# Altium schematic sheet Hall sensor V1 sensor_1.SchDoc
size A2
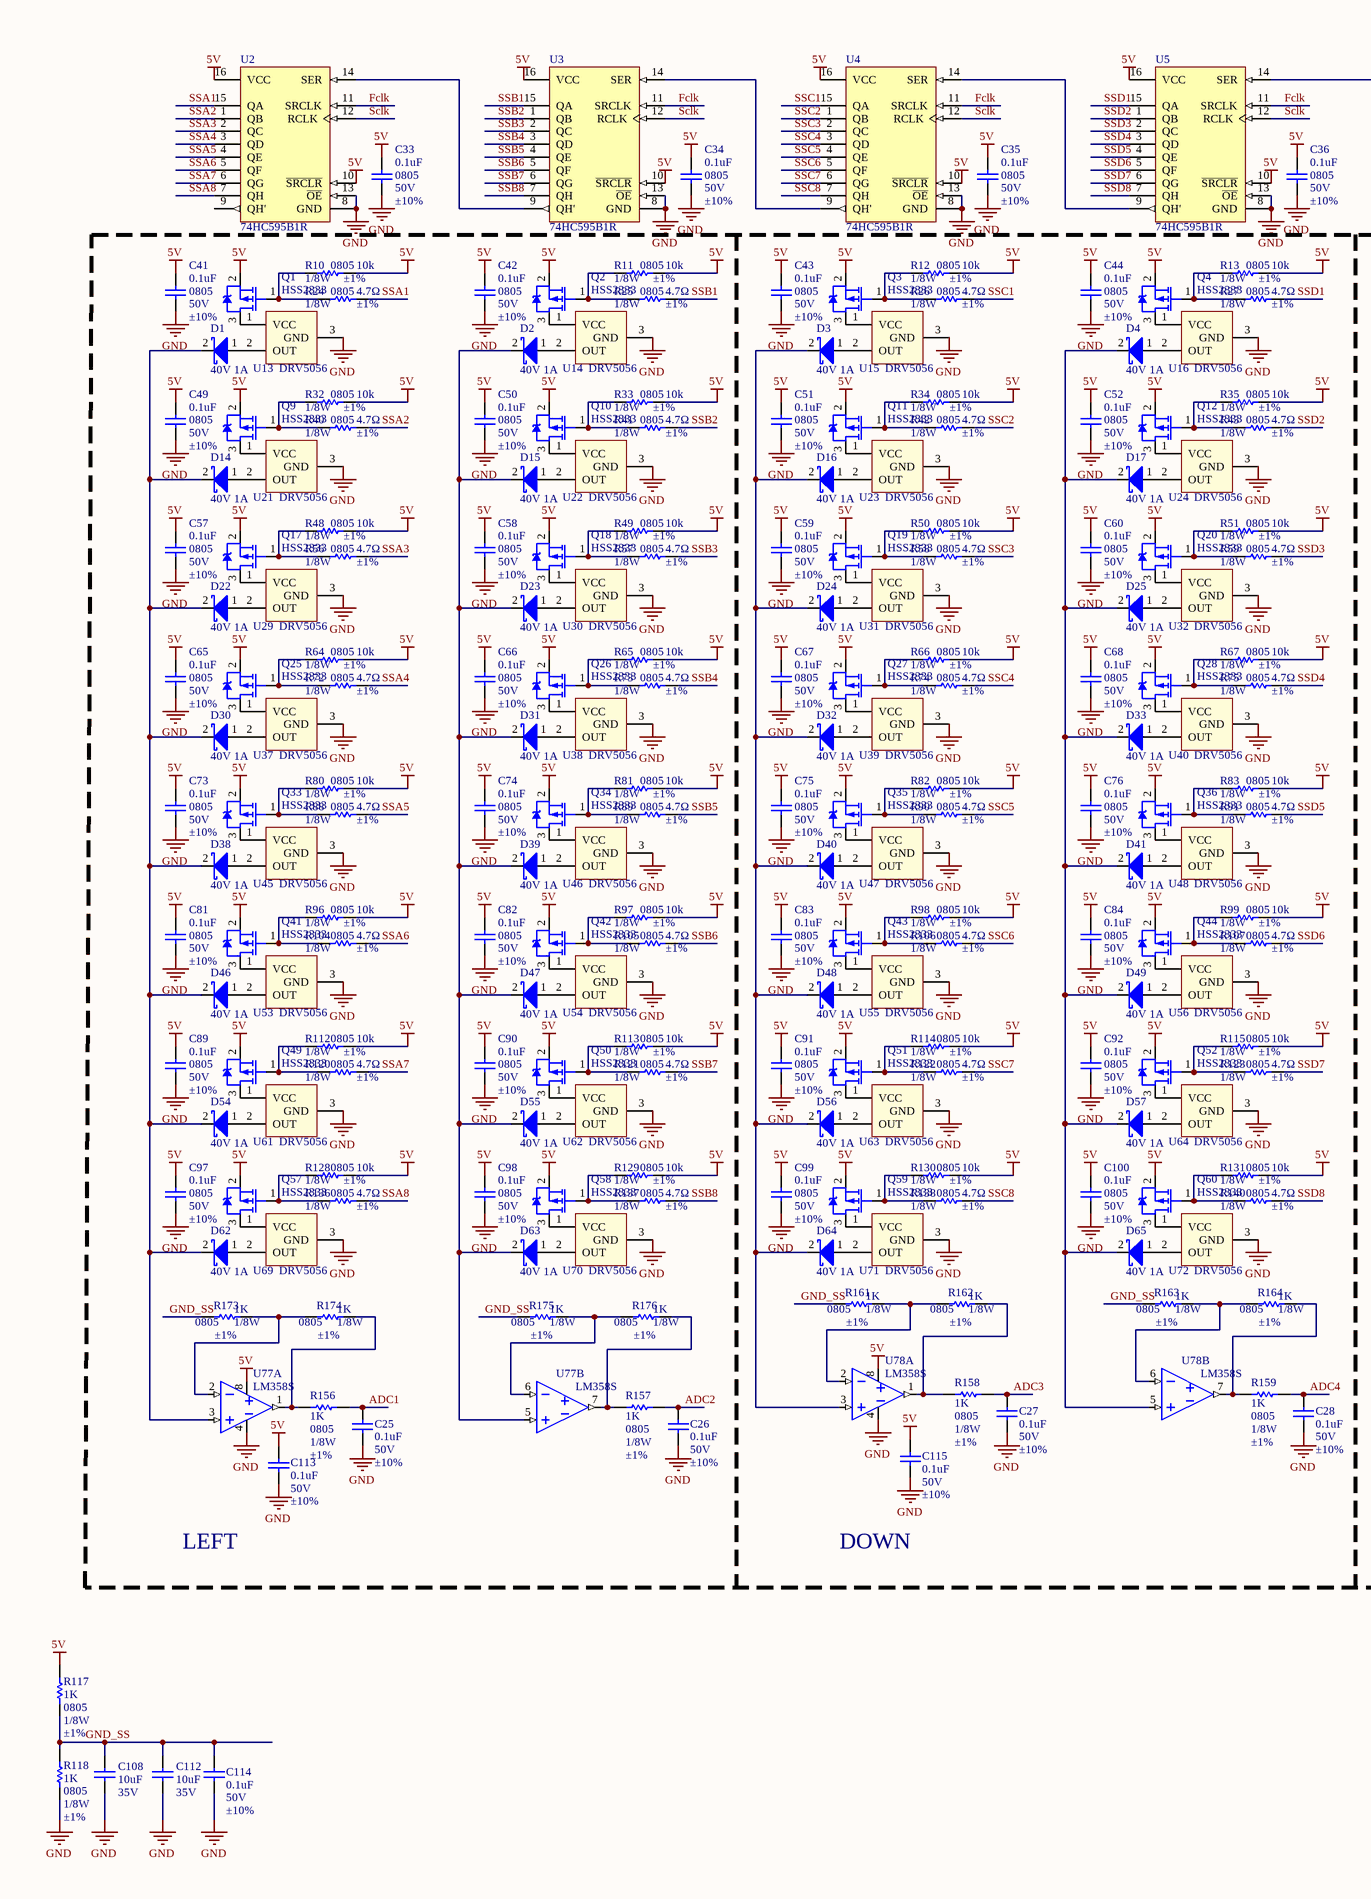
[diagram p0: Hall sensor V1 sensor_1.SchDoc, left]
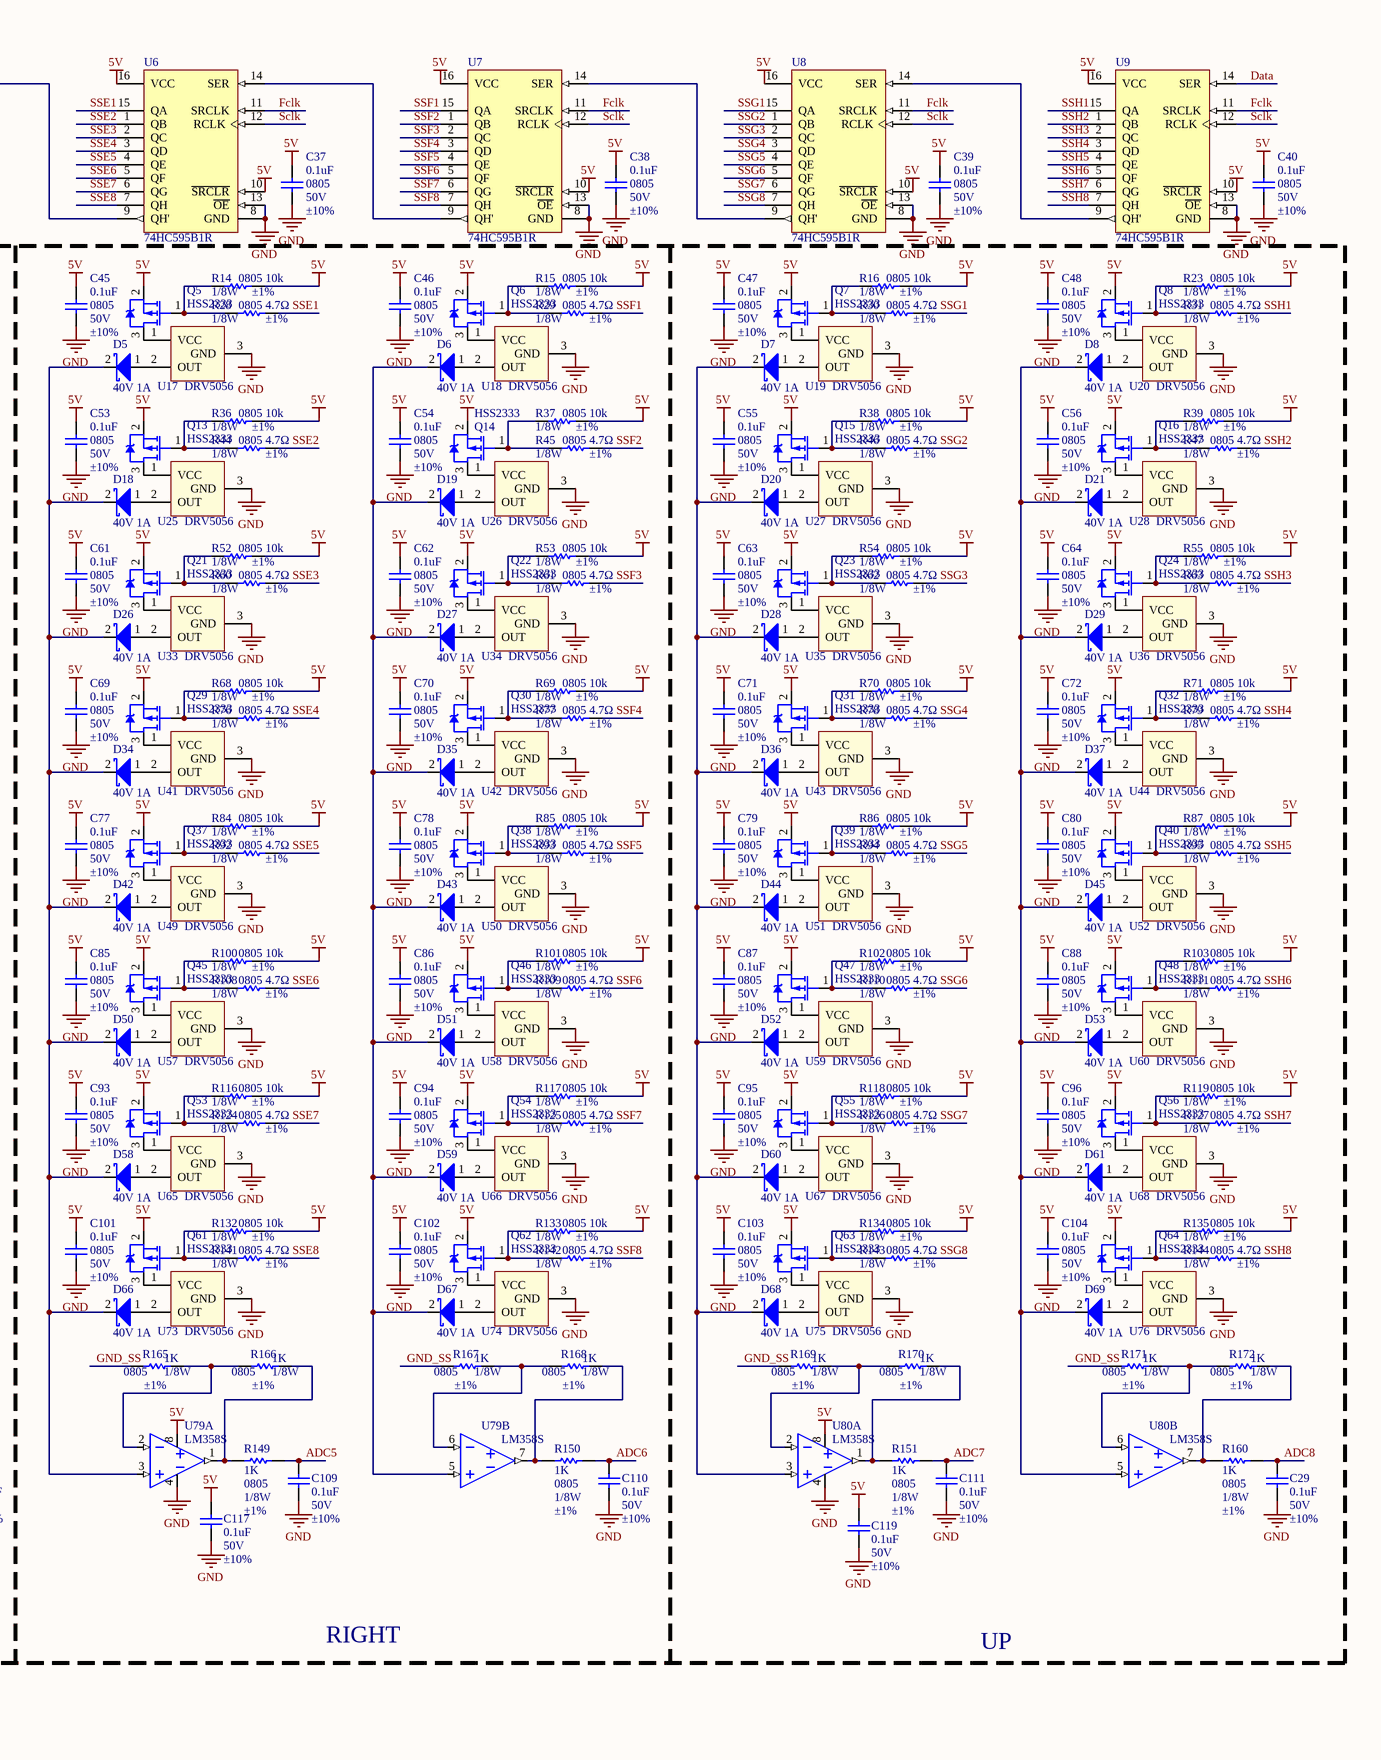
[diagram p1: Hall sensor V1 sensor_1.SchDoc, right]

## Parts
(Parts that share a designator on the sheet are numbered #1, #2 ... from top to bottom, then left to right.)
C25  Voltage: 50V  Tolerance: ±10%  [CAP_SMD_0805]  (hidden comment: 0.1uF)
C26  Voltage: 50V  Tolerance: ±10%  [CAP_SMD_0805]  (hidden comment: 0.1uF)
C27  Voltage: 50V  Tolerance: ±10%  [CAP_SMD_0805]  (hidden comment: 0.1uF)
C28  Voltage: 50V  Tolerance: ±10%  [CAP_SMD_0805]  (hidden comment: 0.1uF)
C29  Voltage: 50V  Tolerance: ±10%  [CAP_SMD_0805]  (hidden comment: 0.1uF)
C33  PCB Footprint: 0805  Voltage: 50V  Tolerance: ±10%  [CAP_SMD_0805]  (hidden comment: 0.1uF)
C34  PCB Footprint: 0805  Voltage: 50V  Tolerance: ±10%  [CAP_SMD_0805]  (hidden comment: 0.1uF)
C35  PCB Footprint: 0805  Voltage: 50V  Tolerance: ±10%  [CAP_SMD_0805]  (hidden comment: 0.1uF)
C36  PCB Footprint: 0805  Voltage: 50V  Tolerance: ±10%  [CAP_SMD_0805]  (hidden comment: 0.1uF)
C37  PCB Footprint: 0805  Voltage: 50V  Tolerance: ±10%  [CAP_SMD_0805]  (hidden comment: 0.1uF)
C38  PCB Footprint: 0805  Voltage: 50V  Tolerance: ±10%  [CAP_SMD_0805]  (hidden comment: 0.1uF)
C39  PCB Footprint: 0805  Voltage: 50V  Tolerance: ±10%  [CAP_SMD_0805]  (hidden comment: 0.1uF)
C40  PCB Footprint: 0805  Voltage: 50V  Tolerance: ±10%  [CAP_SMD_0805]  (hidden comment: 0.1uF)
C41  PCB Footprint: 0805  Voltage: 50V  Tolerance: ±10%  [CAP_SMD_0805]  (hidden comment: 0.1uF)
C42  PCB Footprint: 0805  Voltage: 50V  Tolerance: ±10%  [CAP_SMD_0805]  (hidden comment: 0.1uF)
C43  PCB Footprint: 0805  Voltage: 50V  Tolerance: ±10%  [CAP_SMD_0805]  (hidden comment: 0.1uF)
C44  PCB Footprint: 0805  Voltage: 50V  Tolerance: ±10%  [CAP_SMD_0805]  (hidden comment: 0.1uF)
C45  PCB Footprint: 0805  Voltage: 50V  Tolerance: ±10%  [CAP_SMD_0805]  (hidden comment: 0.1uF)
C46  PCB Footprint: 0805  Voltage: 50V  Tolerance: ±10%  [CAP_SMD_0805]  (hidden comment: 0.1uF)
C47  PCB Footprint: 0805  Voltage: 50V  Tolerance: ±10%  [CAP_SMD_0805]  (hidden comment: 0.1uF)
C48  PCB Footprint: 0805  Voltage: 50V  Tolerance: ±10%  [CAP_SMD_0805]  (hidden comment: 0.1uF)
C49  PCB Footprint: 0805  Voltage: 50V  Tolerance: ±10%  [CAP_SMD_0805]  (hidden comment: 0.1uF)
C50  PCB Footprint: 0805  Voltage: 50V  Tolerance: ±10%  [CAP_SMD_0805]  (hidden comment: 0.1uF)
C51  PCB Footprint: 0805  Voltage: 50V  Tolerance: ±10%  [CAP_SMD_0805]  (hidden comment: 0.1uF)
C52  PCB Footprint: 0805  Voltage: 50V  Tolerance: ±10%  [CAP_SMD_0805]  (hidden comment: 0.1uF)
C53  PCB Footprint: 0805  Voltage: 50V  Tolerance: ±10%  [CAP_SMD_0805]  (hidden comment: 0.1uF)
C54  PCB Footprint: 0805  Voltage: 50V  Tolerance: ±10%  [CAP_SMD_0805]  (hidden comment: 0.1uF)
C55  PCB Footprint: 0805  Voltage: 50V  Tolerance: ±10%  [CAP_SMD_0805]  (hidden comment: 0.1uF)
C56  PCB Footprint: 0805  Voltage: 50V  Tolerance: ±10%  [CAP_SMD_0805]  (hidden comment: 0.1uF)
C57  PCB Footprint: 0805  Voltage: 50V  Tolerance: ±10%  [CAP_SMD_0805]  (hidden comment: 0.1uF)
C58  PCB Footprint: 0805  Voltage: 50V  Tolerance: ±10%  [CAP_SMD_0805]  (hidden comment: 0.1uF)
C59  PCB Footprint: 0805  Voltage: 50V  Tolerance: ±10%  [CAP_SMD_0805]  (hidden comment: 0.1uF)
C60  PCB Footprint: 0805  Voltage: 50V  Tolerance: ±10%  [CAP_SMD_0805]  (hidden comment: 0.1uF)
C61  PCB Footprint: 0805  Voltage: 50V  Tolerance: ±10%  [CAP_SMD_0805]  (hidden comment: 0.1uF)
C62  PCB Footprint: 0805  Voltage: 50V  Tolerance: ±10%  [CAP_SMD_0805]  (hidden comment: 0.1uF)
C63  PCB Footprint: 0805  Voltage: 50V  Tolerance: ±10%  [CAP_SMD_0805]  (hidden comment: 0.1uF)
C64  PCB Footprint: 0805  Voltage: 50V  Tolerance: ±10%  [CAP_SMD_0805]  (hidden comment: 0.1uF)
C65  PCB Footprint: 0805  Voltage: 50V  Tolerance: ±10%  [CAP_SMD_0805]  (hidden comment: 0.1uF)
C66  PCB Footprint: 0805  Voltage: 50V  Tolerance: ±10%  [CAP_SMD_0805]  (hidden comment: 0.1uF)
C67  PCB Footprint: 0805  Voltage: 50V  Tolerance: ±10%  [CAP_SMD_0805]  (hidden comment: 0.1uF)
C68  PCB Footprint: 0805  Voltage: 50V  Tolerance: ±10%  [CAP_SMD_0805]  (hidden comment: 0.1uF)
C69  PCB Footprint: 0805  Voltage: 50V  Tolerance: ±10%  [CAP_SMD_0805]  (hidden comment: 0.1uF)
C70  PCB Footprint: 0805  Voltage: 50V  Tolerance: ±10%  [CAP_SMD_0805]  (hidden comment: 0.1uF)
C71  PCB Footprint: 0805  Voltage: 50V  Tolerance: ±10%  [CAP_SMD_0805]  (hidden comment: 0.1uF)
C72  PCB Footprint: 0805  Voltage: 50V  Tolerance: ±10%  [CAP_SMD_0805]  (hidden comment: 0.1uF)
C73  PCB Footprint: 0805  Voltage: 50V  Tolerance: ±10%  [CAP_SMD_0805]  (hidden comment: 0.1uF)
C74  PCB Footprint: 0805  Voltage: 50V  Tolerance: ±10%  [CAP_SMD_0805]  (hidden comment: 0.1uF)
C75  PCB Footprint: 0805  Voltage: 50V  Tolerance: ±10%  [CAP_SMD_0805]  (hidden comment: 0.1uF)
C76  PCB Footprint: 0805  Voltage: 50V  Tolerance: ±10%  [CAP_SMD_0805]  (hidden comment: 0.1uF)
C77  PCB Footprint: 0805  Voltage: 50V  Tolerance: ±10%  [CAP_SMD_0805]  (hidden comment: 0.1uF)
C78  PCB Footprint: 0805  Voltage: 50V  Tolerance: ±10%  [CAP_SMD_0805]  (hidden comment: 0.1uF)
C79  PCB Footprint: 0805  Voltage: 50V  Tolerance: ±10%  [CAP_SMD_0805]  (hidden comment: 0.1uF)
C80  PCB Footprint: 0805  Voltage: 50V  Tolerance: ±10%  [CAP_SMD_0805]  (hidden comment: 0.1uF)
C81  PCB Footprint: 0805  Voltage: 50V  Tolerance: ±10%  [CAP_SMD_0805]  (hidden comment: 0.1uF)
C82  PCB Footprint: 0805  Voltage: 50V  Tolerance: ±10%  [CAP_SMD_0805]  (hidden comment: 0.1uF)
C83  PCB Footprint: 0805  Voltage: 50V  Tolerance: ±10%  [CAP_SMD_0805]  (hidden comment: 0.1uF)
C84  PCB Footprint: 0805  Voltage: 50V  Tolerance: ±10%  [CAP_SMD_0805]  (hidden comment: 0.1uF)
C85  PCB Footprint: 0805  Voltage: 50V  Tolerance: ±10%  [CAP_SMD_0805]  (hidden comment: 0.1uF)
C86  PCB Footprint: 0805  Voltage: 50V  Tolerance: ±10%  [CAP_SMD_0805]  (hidden comment: 0.1uF)
C87  PCB Footprint: 0805  Voltage: 50V  Tolerance: ±10%  [CAP_SMD_0805]  (hidden comment: 0.1uF)
C88  PCB Footprint: 0805  Voltage: 50V  Tolerance: ±10%  [CAP_SMD_0805]  (hidden comment: 0.1uF)
C89  PCB Footprint: 0805  Voltage: 50V  Tolerance: ±10%  [CAP_SMD_0805]  (hidden comment: 0.1uF)
C90  PCB Footprint: 0805  Voltage: 50V  Tolerance: ±10%  [CAP_SMD_0805]  (hidden comment: 0.1uF)
C91  PCB Footprint: 0805  Voltage: 50V  Tolerance: ±10%  [CAP_SMD_0805]  (hidden comment: 0.1uF)
C92  PCB Footprint: 0805  Voltage: 50V  Tolerance: ±10%  [CAP_SMD_0805]  (hidden comment: 0.1uF)
C93  PCB Footprint: 0805  Voltage: 50V  Tolerance: ±10%  [CAP_SMD_0805]  (hidden comment: 0.1uF)
C94  PCB Footprint: 0805  Voltage: 50V  Tolerance: ±10%  [CAP_SMD_0805]  (hidden comment: 0.1uF)
C95  PCB Footprint: 0805  Voltage: 50V  Tolerance: ±10%  [CAP_SMD_0805]  (hidden comment: 0.1uF)
C96  PCB Footprint: 0805  Voltage: 50V  Tolerance: ±10%  [CAP_SMD_0805]  (hidden comment: 0.1uF)
C97  PCB Footprint: 0805  Voltage: 50V  Tolerance: ±10%  [CAP_SMD_0805]  (hidden comment: 0.1uF)
C98  PCB Footprint: 0805  Voltage: 50V  Tolerance: ±10%  [CAP_SMD_0805]  (hidden comment: 0.1uF)
C99  PCB Footprint: 0805  Voltage: 50V  Tolerance: ±10%  [CAP_SMD_0805]  (hidden comment: 0.1uF)
C100  PCB Footprint: 0805  Voltage: 50V  Tolerance: ±10%  [CAP_SMD_0805]  (hidden comment: 0.1uF)
C101  PCB Footprint: 0805  Voltage: 50V  Tolerance: ±10%  [CAP_SMD_0805]  (hidden comment: 0.1uF)
C102  PCB Footprint: 0805  Voltage: 50V  Tolerance: ±10%  [CAP_SMD_0805]  (hidden comment: 0.1uF)
C103  PCB Footprint: 0805  Voltage: 50V  Tolerance: ±10%  [CAP_SMD_0805]  (hidden comment: 0.1uF)
C104  PCB Footprint: 0805  Voltage: 50V  Tolerance: ±10%  [CAP_SMD_0805]  (hidden comment: 0.1uF)
C108  Voltage: 35V  [CAP_SMD_0805]  (hidden comment: 10uF)
C109  Voltage: 50V  Tolerance: ±10%  [CAP_SMD_0805]  (hidden comment: 0.1uF)
C110  Voltage: 50V  Tolerance: ±10%  [CAP_SMD_0805]  (hidden comment: 0.1uF)
C111  Voltage: 50V  Tolerance: ±10%  [CAP_SMD_0805]  (hidden comment: 0.1uF)
C112  Voltage: 35V  [CAP_SMD_0805]  (hidden comment: 10uF)
C113  Voltage: 50V  Tolerance: ±10%  [CAP_SMD_0805]  (hidden comment: 0.1uF)
C114  Voltage: 50V  Tolerance: ±10%  [CAP_SMD_0805]  (hidden comment: 0.1uF)
C115  Voltage: 50V  Tolerance: ±10%  [CAP_SMD_0805]  (hidden comment: 0.1uF)
C117  Voltage: 50V  Tolerance: ±10%  [CAP_SMD_0805]  (hidden comment: 0.1uF)
C119  Voltage: 50V  Tolerance: ±10%  [CAP_SMD_0805]  (hidden comment: 0.1uF)
D1  40V 1A  [Diode SS14 (DO-214AC)]
D2  40V 1A  [Diode SS14 (DO-214AC)]
D3  40V 1A  [Diode SS14 (DO-214AC)]
D4  40V 1A  [Diode SS14 (DO-214AC)]
D5  40V 1A  [Diode SS14 (DO-214AC)]
D6  40V 1A  [Diode SS14 (DO-214AC)]
D7  40V 1A  [Diode SS14 (DO-214AC)]
D8  40V 1A  [Diode SS14 (DO-214AC)]
D14  40V 1A  [Diode SS14 (DO-214AC)]
D15  40V 1A  [Diode SS14 (DO-214AC)]
D16  40V 1A  [Diode SS14 (DO-214AC)]
D17  40V 1A  [Diode SS14 (DO-214AC)]
D18  40V 1A  [Diode SS14 (DO-214AC)]
D19  40V 1A  [Diode SS14 (DO-214AC)]
D20  40V 1A  [Diode SS14 (DO-214AC)]
D21  40V 1A  [Diode SS14 (DO-214AC)]
D22  40V 1A  [Diode SS14 (DO-214AC)]
D23  40V 1A  [Diode SS14 (DO-214AC)]
D24  40V 1A  [Diode SS14 (DO-214AC)]
D25  40V 1A  [Diode SS14 (DO-214AC)]
D26  40V 1A  [Diode SS14 (DO-214AC)]
D27  40V 1A  [Diode SS14 (DO-214AC)]
D28  40V 1A  [Diode SS14 (DO-214AC)]
D29  40V 1A  [Diode SS14 (DO-214AC)]
D30  40V 1A  [Diode SS14 (DO-214AC)]
D31  40V 1A  [Diode SS14 (DO-214AC)]
D32  40V 1A  [Diode SS14 (DO-214AC)]
D33  40V 1A  [Diode SS14 (DO-214AC)]
D34  40V 1A  [Diode SS14 (DO-214AC)]
D35  40V 1A  [Diode SS14 (DO-214AC)]
D36  40V 1A  [Diode SS14 (DO-214AC)]
D37  40V 1A  [Diode SS14 (DO-214AC)]
D38  40V 1A  [Diode SS14 (DO-214AC)]
D39  40V 1A  [Diode SS14 (DO-214AC)]
D40  40V 1A  [Diode SS14 (DO-214AC)]
D41  40V 1A  [Diode SS14 (DO-214AC)]
D42  40V 1A  [Diode SS14 (DO-214AC)]
D43  40V 1A  [Diode SS14 (DO-214AC)]
D44  40V 1A  [Diode SS14 (DO-214AC)]
D45  40V 1A  [Diode SS14 (DO-214AC)]
D46  40V 1A  [Diode SS14 (DO-214AC)]
D47  40V 1A  [Diode SS14 (DO-214AC)]
D48  40V 1A  [Diode SS14 (DO-214AC)]
D49  40V 1A  [Diode SS14 (DO-214AC)]
D50  40V 1A  [Diode SS14 (DO-214AC)]
D51  40V 1A  [Diode SS14 (DO-214AC)]
D52  40V 1A  [Diode SS14 (DO-214AC)]
D53  40V 1A  [Diode SS14 (DO-214AC)]
D54  40V 1A  [Diode SS14 (DO-214AC)]
D55  40V 1A  [Diode SS14 (DO-214AC)]
D56  40V 1A  [Diode SS14 (DO-214AC)]
D57  40V 1A  [Diode SS14 (DO-214AC)]
D58  40V 1A  [Diode SS14 (DO-214AC)]
D59  40V 1A  [Diode SS14 (DO-214AC)]
D60  40V 1A  [Diode SS14 (DO-214AC)]
D61  40V 1A  [Diode SS14 (DO-214AC)]
D62  40V 1A  [Diode SS14 (DO-214AC)]
D63  40V 1A  [Diode SS14 (DO-214AC)]
D64  40V 1A  [Diode SS14 (DO-214AC)]
D65  40V 1A  [Diode SS14 (DO-214AC)]
D66  40V 1A  [Diode SS14 (DO-214AC)]
D67  40V 1A  [Diode SS14 (DO-214AC)]
D68  40V 1A  [Diode SS14 (DO-214AC)]
D69  40V 1A  [Diode SS14 (DO-214AC)]
Q1  HSS2333  [SOT23-3_2M9X2M8X1M1]
Q2  HSS2333  [SOT23-3_2M9X2M8X1M1]
Q3  HSS2333  [SOT23-3_2M9X2M8X1M1]
Q4  HSS2333  [SOT23-3_2M9X2M8X1M1]
Q5  HSS2333  [SOT23-3_2M9X2M8X1M1]
Q6  HSS2333  [SOT23-3_2M9X2M8X1M1]
Q7  HSS2333  [SOT23-3_2M9X2M8X1M1]
Q8  HSS2333  [SOT23-3_2M9X2M8X1M1]
Q9  HSS2333  [SOT23-3_2M9X2M8X1M1]
Q10  HSS2333  [SOT23-3_2M9X2M8X1M1]
Q11  HSS2333  [SOT23-3_2M9X2M8X1M1]
Q12  HSS2333  [SOT23-3_2M9X2M8X1M1]
Q13  HSS2333  [SOT23-3_2M9X2M8X1M1]
Q14  HSS2333  [SOT23-3_2M9X2M8X1M1]
Q15  HSS2333  [SOT23-3_2M9X2M8X1M1]
Q16  HSS2333  [SOT23-3_2M9X2M8X1M1]
Q17  HSS2333  [SOT23-3_2M9X2M8X1M1]
Q18  HSS2333  [SOT23-3_2M9X2M8X1M1]
Q19  HSS2333  [SOT23-3_2M9X2M8X1M1]
Q20  HSS2333  [SOT23-3_2M9X2M8X1M1]
Q21  HSS2333  [SOT23-3_2M9X2M8X1M1]
Q22  HSS2333  [SOT23-3_2M9X2M8X1M1]
Q23  HSS2333  [SOT23-3_2M9X2M8X1M1]
Q24  HSS2333  [SOT23-3_2M9X2M8X1M1]
Q25  HSS2333  [SOT23-3_2M9X2M8X1M1]
Q26  HSS2333  [SOT23-3_2M9X2M8X1M1]
Q27  HSS2333  [SOT23-3_2M9X2M8X1M1]
Q28  HSS2333  [SOT23-3_2M9X2M8X1M1]
Q29  HSS2333  [SOT23-3_2M9X2M8X1M1]
Q30  HSS2333  [SOT23-3_2M9X2M8X1M1]
Q31  HSS2333  [SOT23-3_2M9X2M8X1M1]
Q32  HSS2333  [SOT23-3_2M9X2M8X1M1]
Q33  HSS2333  [SOT23-3_2M9X2M8X1M1]
Q34  HSS2333  [SOT23-3_2M9X2M8X1M1]
Q35  HSS2333  [SOT23-3_2M9X2M8X1M1]
Q36  HSS2333  [SOT23-3_2M9X2M8X1M1]
Q37  HSS2333  [SOT23-3_2M9X2M8X1M1]
Q38  HSS2333  [SOT23-3_2M9X2M8X1M1]
Q39  HSS2333  [SOT23-3_2M9X2M8X1M1]
Q40  HSS2333  [SOT23-3_2M9X2M8X1M1]
Q41  HSS2333  [SOT23-3_2M9X2M8X1M1]
Q42  HSS2333  [SOT23-3_2M9X2M8X1M1]
Q43  HSS2333  [SOT23-3_2M9X2M8X1M1]
Q44  HSS2333  [SOT23-3_2M9X2M8X1M1]
Q45  HSS2333  [SOT23-3_2M9X2M8X1M1]
Q46  HSS2333  [SOT23-3_2M9X2M8X1M1]
Q47  HSS2333  [SOT23-3_2M9X2M8X1M1]
Q48  HSS2333  [SOT23-3_2M9X2M8X1M1]
Q49  HSS2333  [SOT23-3_2M9X2M8X1M1]
Q50  HSS2333  [SOT23-3_2M9X2M8X1M1]
Q51  HSS2333  [SOT23-3_2M9X2M8X1M1]
Q52  HSS2333  [SOT23-3_2M9X2M8X1M1]
Q53  HSS2333  [SOT23-3_2M9X2M8X1M1]
Q54  HSS2333  [SOT23-3_2M9X2M8X1M1]
Q55  HSS2333  [SOT23-3_2M9X2M8X1M1]
Q56  HSS2333  [SOT23-3_2M9X2M8X1M1]
Q57  HSS2333  [SOT23-3_2M9X2M8X1M1]
Q58  HSS2333  [SOT23-3_2M9X2M8X1M1]
Q59  HSS2333  [SOT23-3_2M9X2M8X1M1]
Q60  HSS2333  [SOT23-3_2M9X2M8X1M1]
Q61  HSS2333  [SOT23-3_2M9X2M8X1M1]
Q62  HSS2333  [SOT23-3_2M9X2M8X1M1]
Q63  HSS2333  [SOT23-3_2M9X2M8X1M1]
Q64  HSS2333  [SOT23-3_2M9X2M8X1M1]
R10  PCB Footprint: 0805  Power: 1/8W  Tolerance: ±1%  [RES_SMD_0805]  (hidden comment: 10k)
R11  PCB Footprint: 0805  Power: 1/8W  Tolerance: ±1%  [RES_SMD_0805]  (hidden comment: 10k)
R12  PCB Footprint: 0805  Power: 1/8W  Tolerance: ±1%  [RES_SMD_0805]  (hidden comment: 10k)
R13  PCB Footprint: 0805  Power: 1/8W  Tolerance: ±1%  [RES_SMD_0805]  (hidden comment: 10k)
R14  PCB Footprint: 0805  Power: 1/8W  Tolerance: ±1%  [RES_SMD_0805]  (hidden comment: 10k)
R15  PCB Footprint: 0805  Power: 1/8W  Tolerance: ±1%  [RES_SMD_0805]  (hidden comment: 10k)
R16  PCB Footprint: 0805  Power: 1/8W  Tolerance: ±1%  [RES_SMD_0805]  (hidden comment: 10k)
R23  PCB Footprint: 0805  Power: 1/8W  Tolerance: ±1%  [RES_SMD_0805]  (hidden comment: 10k)
R24  value 4.7Ω  PCB Footprint: 0805  Power: 1/8W  Tolerance: ±1%  [RES_SMD_0805]  (hidden comment: 4.7R)
R25  value 4.7Ω  PCB Footprint: 0805  Power: 1/8W  Tolerance: ±1%  [RES_SMD_0805]  (hidden comment: 4.7R)
R26  value 4.7Ω  PCB Footprint: 0805  Power: 1/8W  Tolerance: ±1%  [RES_SMD_0805]  (hidden comment: 4.7R)
R27  value 4.7Ω  PCB Footprint: 0805  Power: 1/8W  Tolerance: ±1%  [RES_SMD_0805]  (hidden comment: 4.7R)
R28  value 4.7Ω  PCB Footprint: 0805  Power: 1/8W  Tolerance: ±1%  [RES_SMD_0805]  (hidden comment: 4.7R)
R29  value 4.7Ω  PCB Footprint: 0805  Power: 1/8W  Tolerance: ±1%  [RES_SMD_0805]  (hidden comment: 4.7R)
R30  value 4.7Ω  PCB Footprint: 0805  Power: 1/8W  Tolerance: ±1%  [RES_SMD_0805]  (hidden comment: 4.7R)
R31  value 4.7Ω  PCB Footprint: 0805  Power: 1/8W  Tolerance: ±1%  [RES_SMD_0805]  (hidden comment: 4.7R)
R32  PCB Footprint: 0805  Power: 1/8W  Tolerance: ±1%  [RES_SMD_0805]  (hidden comment: 10k)
R33  PCB Footprint: 0805  Power: 1/8W  Tolerance: ±1%  [RES_SMD_0805]  (hidden comment: 10k)
R34  PCB Footprint: 0805  Power: 1/8W  Tolerance: ±1%  [RES_SMD_0805]  (hidden comment: 10k)
R35  PCB Footprint: 0805  Power: 1/8W  Tolerance: ±1%  [RES_SMD_0805]  (hidden comment: 10k)
R36  PCB Footprint: 0805  Power: 1/8W  Tolerance: ±1%  [RES_SMD_0805]  (hidden comment: 10k)
R37  PCB Footprint: 0805  Power: 1/8W  Tolerance: ±1%  [RES_SMD_0805]  (hidden comment: 10k)
R38  PCB Footprint: 0805  Power: 1/8W  Tolerance: ±1%  [RES_SMD_0805]  (hidden comment: 10k)
R39  PCB Footprint: 0805  Power: 1/8W  Tolerance: ±1%  [RES_SMD_0805]  (hidden comment: 10k)
R40  value 4.7Ω  PCB Footprint: 0805  Power: 1/8W  Tolerance: ±1%  [RES_SMD_0805]  (hidden comment: 4.7R)
R41  value 4.7Ω  PCB Footprint: 0805  Power: 1/8W  Tolerance: ±1%  [RES_SMD_0805]  (hidden comment: 4.7R)
R42  value 4.7Ω  PCB Footprint: 0805  Power: 1/8W  Tolerance: ±1%  [RES_SMD_0805]  (hidden comment: 4.7R)
R43  value 4.7Ω  PCB Footprint: 0805  Power: 1/8W  Tolerance: ±1%  [RES_SMD_0805]  (hidden comment: 4.7R)
R44  value 4.7Ω  PCB Footprint: 0805  Power: 1/8W  Tolerance: ±1%  [RES_SMD_0805]  (hidden comment: 4.7R)
R45  value 4.7Ω  PCB Footprint: 0805  Power: 1/8W  Tolerance: ±1%  [RES_SMD_0805]  (hidden comment: 4.7R)
R46  value 4.7Ω  PCB Footprint: 0805  Power: 1/8W  Tolerance: ±1%  [RES_SMD_0805]  (hidden comment: 4.7R)
R47  value 4.7Ω  PCB Footprint: 0805  Power: 1/8W  Tolerance: ±1%  [RES_SMD_0805]  (hidden comment: 4.7R)
R48  PCB Footprint: 0805  Power: 1/8W  Tolerance: ±1%  [RES_SMD_0805]  (hidden comment: 10k)
R49  PCB Footprint: 0805  Power: 1/8W  Tolerance: ±1%  [RES_SMD_0805]  (hidden comment: 10k)
R50  PCB Footprint: 0805  Power: 1/8W  Tolerance: ±1%  [RES_SMD_0805]  (hidden comment: 10k)
R51  PCB Footprint: 0805  Power: 1/8W  Tolerance: ±1%  [RES_SMD_0805]  (hidden comment: 10k)
R52  PCB Footprint: 0805  Power: 1/8W  Tolerance: ±1%  [RES_SMD_0805]  (hidden comment: 10k)
R53  PCB Footprint: 0805  Power: 1/8W  Tolerance: ±1%  [RES_SMD_0805]  (hidden comment: 10k)
R54  PCB Footprint: 0805  Power: 1/8W  Tolerance: ±1%  [RES_SMD_0805]  (hidden comment: 10k)
R55  PCB Footprint: 0805  Power: 1/8W  Tolerance: ±1%  [RES_SMD_0805]  (hidden comment: 10k)
R56  value 4.7Ω  PCB Footprint: 0805  Power: 1/8W  Tolerance: ±1%  [RES_SMD_0805]  (hidden comment: 4.7R)
R57  value 4.7Ω  PCB Footprint: 0805  Power: 1/8W  Tolerance: ±1%  [RES_SMD_0805]  (hidden comment: 4.7R)
R58  value 4.7Ω  PCB Footprint: 0805  Power: 1/8W  Tolerance: ±1%  [RES_SMD_0805]  (hidden comment: 4.7R)
R59  value 4.7Ω  PCB Footprint: 0805  Power: 1/8W  Tolerance: ±1%  [RES_SMD_0805]  (hidden comment: 4.7R)
R60  value 4.7Ω  PCB Footprint: 0805  Power: 1/8W  Tolerance: ±1%  [RES_SMD_0805]  (hidden comment: 4.7R)
R61  value 4.7Ω  PCB Footprint: 0805  Power: 1/8W  Tolerance: ±1%  [RES_SMD_0805]  (hidden comment: 4.7R)
R62  value 4.7Ω  PCB Footprint: 0805  Power: 1/8W  Tolerance: ±1%  [RES_SMD_0805]  (hidden comment: 4.7R)
R63  value 4.7Ω  PCB Footprint: 0805  Power: 1/8W  Tolerance: ±1%  [RES_SMD_0805]  (hidden comment: 4.7R)
R64  PCB Footprint: 0805  Power: 1/8W  Tolerance: ±1%  [RES_SMD_0805]  (hidden comment: 10k)
R65  PCB Footprint: 0805  Power: 1/8W  Tolerance: ±1%  [RES_SMD_0805]  (hidden comment: 10k)
R66  PCB Footprint: 0805  Power: 1/8W  Tolerance: ±1%  [RES_SMD_0805]  (hidden comment: 10k)
R67  PCB Footprint: 0805  Power: 1/8W  Tolerance: ±1%  [RES_SMD_0805]  (hidden comment: 10k)
R68  PCB Footprint: 0805  Power: 1/8W  Tolerance: ±1%  [RES_SMD_0805]  (hidden comment: 10k)
R69  PCB Footprint: 0805  Power: 1/8W  Tolerance: ±1%  [RES_SMD_0805]  (hidden comment: 10k)
R70  PCB Footprint: 0805  Power: 1/8W  Tolerance: ±1%  [RES_SMD_0805]  (hidden comment: 10k)
R71  PCB Footprint: 0805  Power: 1/8W  Tolerance: ±1%  [RES_SMD_0805]  (hidden comment: 10k)
R72  value 4.7Ω  PCB Footprint: 0805  Power: 1/8W  Tolerance: ±1%  [RES_SMD_0805]  (hidden comment: 4.7R)
R73  value 4.7Ω  PCB Footprint: 0805  Power: 1/8W  Tolerance: ±1%  [RES_SMD_0805]  (hidden comment: 4.7R)
R74  value 4.7Ω  PCB Footprint: 0805  Power: 1/8W  Tolerance: ±1%  [RES_SMD_0805]  (hidden comment: 4.7R)
R75  value 4.7Ω  PCB Footprint: 0805  Power: 1/8W  Tolerance: ±1%  [RES_SMD_0805]  (hidden comment: 4.7R)
R76  value 4.7Ω  PCB Footprint: 0805  Power: 1/8W  Tolerance: ±1%  [RES_SMD_0805]  (hidden comment: 4.7R)
R77  value 4.7Ω  PCB Footprint: 0805  Power: 1/8W  Tolerance: ±1%  [RES_SMD_0805]  (hidden comment: 4.7R)
R78  value 4.7Ω  PCB Footprint: 0805  Power: 1/8W  Tolerance: ±1%  [RES_SMD_0805]  (hidden comment: 4.7R)
R79  value 4.7Ω  PCB Footprint: 0805  Power: 1/8W  Tolerance: ±1%  [RES_SMD_0805]  (hidden comment: 4.7R)
R80  PCB Footprint: 0805  Power: 1/8W  Tolerance: ±1%  [RES_SMD_0805]  (hidden comment: 10k)
R81  PCB Footprint: 0805  Power: 1/8W  Tolerance: ±1%  [RES_SMD_0805]  (hidden comment: 10k)
R82  PCB Footprint: 0805  Power: 1/8W  Tolerance: ±1%  [RES_SMD_0805]  (hidden comment: 10k)
R83  PCB Footprint: 0805  Power: 1/8W  Tolerance: ±1%  [RES_SMD_0805]  (hidden comment: 10k)
R84  PCB Footprint: 0805  Power: 1/8W  Tolerance: ±1%  [RES_SMD_0805]  (hidden comment: 10k)
R85  PCB Footprint: 0805  Power: 1/8W  Tolerance: ±1%  [RES_SMD_0805]  (hidden comment: 10k)
R86  PCB Footprint: 0805  Power: 1/8W  Tolerance: ±1%  [RES_SMD_0805]  (hidden comment: 10k)
R87  PCB Footprint: 0805  Power: 1/8W  Tolerance: ±1%  [RES_SMD_0805]  (hidden comment: 10k)
R88  value 4.7Ω  PCB Footprint: 0805  Power: 1/8W  Tolerance: ±1%  [RES_SMD_0805]  (hidden comment: 4.7R)
R89  value 4.7Ω  PCB Footprint: 0805  Power: 1/8W  Tolerance: ±1%  [RES_SMD_0805]  (hidden comment: 4.7R)
R90  value 4.7Ω  PCB Footprint: 0805  Power: 1/8W  Tolerance: ±1%  [RES_SMD_0805]  (hidden comment: 4.7R)
R91  value 4.7Ω  PCB Footprint: 0805  Power: 1/8W  Tolerance: ±1%  [RES_SMD_0805]  (hidden comment: 4.7R)
R92  value 4.7Ω  PCB Footprint: 0805  Power: 1/8W  Tolerance: ±1%  [RES_SMD_0805]  (hidden comment: 4.7R)
R93  value 4.7Ω  PCB Footprint: 0805  Power: 1/8W  Tolerance: ±1%  [RES_SMD_0805]  (hidden comment: 4.7R)
R94  value 4.7Ω  PCB Footprint: 0805  Power: 1/8W  Tolerance: ±1%  [RES_SMD_0805]  (hidden comment: 4.7R)
R95  value 4.7Ω  PCB Footprint: 0805  Power: 1/8W  Tolerance: ±1%  [RES_SMD_0805]  (hidden comment: 4.7R)
R96  PCB Footprint: 0805  Power: 1/8W  Tolerance: ±1%  [RES_SMD_0805]  (hidden comment: 10k)
R97  PCB Footprint: 0805  Power: 1/8W  Tolerance: ±1%  [RES_SMD_0805]  (hidden comment: 10k)
R98  PCB Footprint: 0805  Power: 1/8W  Tolerance: ±1%  [RES_SMD_0805]  (hidden comment: 10k)
R99  PCB Footprint: 0805  Power: 1/8W  Tolerance: ±1%  [RES_SMD_0805]  (hidden comment: 10k)
R100  PCB Footprint: 0805  Power: 1/8W  Tolerance: ±1%  [RES_SMD_0805]  (hidden comment: 10k)
R101  PCB Footprint: 0805  Power: 1/8W  Tolerance: ±1%  [RES_SMD_0805]  (hidden comment: 10k)
R102  PCB Footprint: 0805  Power: 1/8W  Tolerance: ±1%  [RES_SMD_0805]  (hidden comment: 10k)
R103  PCB Footprint: 0805  Power: 1/8W  Tolerance: ±1%  [RES_SMD_0805]  (hidden comment: 10k)
R104  value 4.7Ω  PCB Footprint: 0805  Power: 1/8W  Tolerance: ±1%  [RES_SMD_0805]  (hidden comment: 4.7R)
R105  value 4.7Ω  PCB Footprint: 0805  Power: 1/8W  Tolerance: ±1%  [RES_SMD_0805]  (hidden comment: 4.7R)
R106  value 4.7Ω  PCB Footprint: 0805  Power: 1/8W  Tolerance: ±1%  [RES_SMD_0805]  (hidden comment: 4.7R)
R107  value 4.7Ω  PCB Footprint: 0805  Power: 1/8W  Tolerance: ±1%  [RES_SMD_0805]  (hidden comment: 4.7R)
R108  value 4.7Ω  PCB Footprint: 0805  Power: 1/8W  Tolerance: ±1%  [RES_SMD_0805]  (hidden comment: 4.7R)
R109  value 4.7Ω  PCB Footprint: 0805  Power: 1/8W  Tolerance: ±1%  [RES_SMD_0805]  (hidden comment: 4.7R)
R110  value 4.7Ω  PCB Footprint: 0805  Power: 1/8W  Tolerance: ±1%  [RES_SMD_0805]  (hidden comment: 4.7R)
R111  value 4.7Ω  PCB Footprint: 0805  Power: 1/8W  Tolerance: ±1%  [RES_SMD_0805]  (hidden comment: 4.7R)
R112  PCB Footprint: 0805  Power: 1/8W  Tolerance: ±1%  [RES_SMD_0805]  (hidden comment: 10k)
R113  PCB Footprint: 0805  Power: 1/8W  Tolerance: ±1%  [RES_SMD_0805]  (hidden comment: 10k)
R114  PCB Footprint: 0805  Power: 1/8W  Tolerance: ±1%  [RES_SMD_0805]  (hidden comment: 10k)
R115  PCB Footprint: 0805  Power: 1/8W  Tolerance: ±1%  [RES_SMD_0805]  (hidden comment: 10k)
R116  PCB Footprint: 0805  Power: 1/8W  Tolerance: ±1%  [RES_SMD_0805]  (hidden comment: 10k)
R117#1  PCB Footprint: 0805  Power: 1/8W  Tolerance: ±1%  [RES_SMD_0805]  (hidden comment: 10k)
R117#2  PCB Footprint: 0805  Power: 1/8W  Tolerance: ±1%  [RES_SMD_0805]  (hidden comment: 1k)
R118#1  PCB Footprint: 0805  Power: 1/8W  Tolerance: ±1%  [RES_SMD_0805]  (hidden comment: 10k)
R118#2  PCB Footprint: 0805  Power: 1/8W  Tolerance: ±1%  [RES_SMD_0805]  (hidden comment: 1k)
R119  PCB Footprint: 0805  Power: 1/8W  Tolerance: ±1%  [RES_SMD_0805]  (hidden comment: 10k)
R120  value 4.7Ω  PCB Footprint: 0805  Power: 1/8W  Tolerance: ±1%  [RES_SMD_0805]  (hidden comment: 4.7R)
R121  value 4.7Ω  PCB Footprint: 0805  Power: 1/8W  Tolerance: ±1%  [RES_SMD_0805]  (hidden comment: 4.7R)
R122  value 4.7Ω  PCB Footprint: 0805  Power: 1/8W  Tolerance: ±1%  [RES_SMD_0805]  (hidden comment: 4.7R)
R123  value 4.7Ω  PCB Footprint: 0805  Power: 1/8W  Tolerance: ±1%  [RES_SMD_0805]  (hidden comment: 4.7R)
R124  value 4.7Ω  PCB Footprint: 0805  Power: 1/8W  Tolerance: ±1%  [RES_SMD_0805]  (hidden comment: 4.7R)
R125  value 4.7Ω  PCB Footprint: 0805  Power: 1/8W  Tolerance: ±1%  [RES_SMD_0805]  (hidden comment: 4.7R)
R126  value 4.7Ω  PCB Footprint: 0805  Power: 1/8W  Tolerance: ±1%  [RES_SMD_0805]  (hidden comment: 4.7R)
R127  value 4.7Ω  PCB Footprint: 0805  Power: 1/8W  Tolerance: ±1%  [RES_SMD_0805]  (hidden comment: 4.7R)
R128  PCB Footprint: 0805  Power: 1/8W  Tolerance: ±1%  [RES_SMD_0805]  (hidden comment: 10k)
R129  PCB Footprint: 0805  Power: 1/8W  Tolerance: ±1%  [RES_SMD_0805]  (hidden comment: 10k)
R130  PCB Footprint: 0805  Power: 1/8W  Tolerance: ±1%  [RES_SMD_0805]  (hidden comment: 10k)
R131  PCB Footprint: 0805  Power: 1/8W  Tolerance: ±1%  [RES_SMD_0805]  (hidden comment: 10k)
R132  PCB Footprint: 0805  Power: 1/8W  Tolerance: ±1%  [RES_SMD_0805]  (hidden comment: 10k)
R133  PCB Footprint: 0805  Power: 1/8W  Tolerance: ±1%  [RES_SMD_0805]  (hidden comment: 10k)
R134  PCB Footprint: 0805  Power: 1/8W  Tolerance: ±1%  [RES_SMD_0805]  (hidden comment: 10k)
R135  PCB Footprint: 0805  Power: 1/8W  Tolerance: ±1%  [RES_SMD_0805]  (hidden comment: 10k)
R136  value 4.7Ω  PCB Footprint: 0805  Power: 1/8W  Tolerance: ±1%  [RES_SMD_0805]  (hidden comment: 4.7R)
R137  value 4.7Ω  PCB Footprint: 0805  Power: 1/8W  Tolerance: ±1%  [RES_SMD_0805]  (hidden comment: 4.7R)
R138  value 4.7Ω  PCB Footprint: 0805  Power: 1/8W  Tolerance: ±1%  [RES_SMD_0805]  (hidden comment: 4.7R)
R140  value 4.7Ω  PCB Footprint: 0805  Power: 1/8W  Tolerance: ±1%  [RES_SMD_0805]  (hidden comment: 4.7R)
R141  value 4.7Ω  PCB Footprint: 0805  Power: 1/8W  Tolerance: ±1%  [RES_SMD_0805]  (hidden comment: 4.7R)
R142  value 4.7Ω  PCB Footprint: 0805  Power: 1/8W  Tolerance: ±1%  [RES_SMD_0805]  (hidden comment: 4.7R)
R143  value 4.7Ω  PCB Footprint: 0805  Power: 1/8W  Tolerance: ±1%  [RES_SMD_0805]  (hidden comment: 4.7R)
R144  value 4.7Ω  PCB Footprint: 0805  Power: 1/8W  Tolerance: ±1%  [RES_SMD_0805]  (hidden comment: 4.7R)
R149  PCB Footprint: 0805  Power: 1/8W  Tolerance: ±1%  [RES_SMD_0805]  (hidden comment: 1k)
R150  PCB Footprint: 0805  Power: 1/8W  Tolerance: ±1%  [RES_SMD_0805]  (hidden comment: 1k)
R151  PCB Footprint: 0805  Power: 1/8W  Tolerance: ±1%  [RES_SMD_0805]  (hidden comment: 1k)
R156  PCB Footprint: 0805  Power: 1/8W  Tolerance: ±1%  [RES_SMD_0805]  (hidden comment: 1k)
R157  PCB Footprint: 0805  Power: 1/8W  Tolerance: ±1%  [RES_SMD_0805]  (hidden comment: 1k)
R158  PCB Footprint: 0805  Power: 1/8W  Tolerance: ±1%  [RES_SMD_0805]  (hidden comment: 1k)
R159  PCB Footprint: 0805  Power: 1/8W  Tolerance: ±1%  [RES_SMD_0805]  (hidden comment: 1k)
R160  PCB Footprint: 0805  Power: 1/8W  Tolerance: ±1%  [RES_SMD_0805]  (hidden comment: 1k)
R161  PCB Footprint: 0805  Power: 1/8W  Tolerance: ±1%  [RES_SMD_0805]  (hidden comment: 1k)
R162  PCB Footprint: 0805  Power: 1/8W  Tolerance: ±1%  [RES_SMD_0805]  (hidden comment: 1k)
R163  PCB Footprint: 0805  Power: 1/8W  Tolerance: ±1%  [RES_SMD_0805]  (hidden comment: 1k)
R164  PCB Footprint: 0805  Power: 1/8W  Tolerance: ±1%  [RES_SMD_0805]  (hidden comment: 1k)
R165  PCB Footprint: 0805  Power: 1/8W  Tolerance: ±1%  [RES_SMD_0805]  (hidden comment: 1k)
R166  PCB Footprint: 0805  Power: 1/8W  Tolerance: ±1%  [RES_SMD_0805]  (hidden comment: 1k)
R167  PCB Footprint: 0805  Power: 1/8W  Tolerance: ±1%  [RES_SMD_0805]  (hidden comment: 1k)
R168  PCB Footprint: 0805  Power: 1/8W  Tolerance: ±1%  [RES_SMD_0805]  (hidden comment: 1k)
R169  PCB Footprint: 0805  Power: 1/8W  Tolerance: ±1%  [RES_SMD_0805]  (hidden comment: 1k)
R170  PCB Footprint: 0805  Power: 1/8W  Tolerance: ±1%  [RES_SMD_0805]  (hidden comment: 1k)
R171  PCB Footprint: 0805  Power: 1/8W  Tolerance: ±1%  [RES_SMD_0805]  (hidden comment: 1k)
R172  PCB Footprint: 0805  Power: 1/8W  Tolerance: ±1%  [RES_SMD_0805]  (hidden comment: 1k)
R173  PCB Footprint: 0805  Power: 1/8W  Tolerance: ±1%  [RES_SMD_0805]  (hidden comment: 1k)
R174  PCB Footprint: 0805  Power: 1/8W  Tolerance: ±1%  [RES_SMD_0805]  (hidden comment: 1k)
R175  PCB Footprint: 0805  Power: 1/8W  Tolerance: ±1%  [RES_SMD_0805]  (hidden comment: 1k)
R176  PCB Footprint: 0805  Power: 1/8W  Tolerance: ±1%  [RES_SMD_0805]  (hidden comment: 1k)
U2  74HC595B1R  [SOIC16-S]
U3  74HC595B1R  [SOIC16-S]
U4  74HC595B1R  [SOIC16-S]
U5  74HC595B1R  [SOIC16-S]
U6  74HC595B1R  [SOIC16-S]
U7  74HC595B1R  [SOIC16-S]
U8  74HC595B1R  [SOIC16-S]
U9  74HC595B1R  [SOIC16-S]
U13  DRV5056  [SOT-23]
U14  DRV5056  [SOT-23]
U15  DRV5056  [SOT-23]
U16  DRV5056  [SOT-23]
U17  DRV5056  [SOT-23]
U18  DRV5056  [SOT-23]
U19  DRV5056  [SOT-23]
U20  DRV5056  [SOT-23]
U21  DRV5056  [SOT-23]
U22  DRV5056  [SOT-23]
U23  DRV5056  [SOT-23]
U24  DRV5056  [SOT-23]
U25  DRV5056  [SOT-23]
U26  DRV5056  [SOT-23]
U27  DRV5056  [SOT-23]
U28  DRV5056  [SOT-23]
U29  DRV5056  [SOT-23]
U30  DRV5056  [SOT-23]
U31  DRV5056  [SOT-23]
U32  DRV5056  [SOT-23]
U33  DRV5056  [SOT-23]
U34  DRV5056  [SOT-23]
U35  DRV5056  [SOT-23]
U36  DRV5056  [SOT-23]
U37  DRV5056  [SOT-23]
U38  DRV5056  [SOT-23]
U39  DRV5056  [SOT-23]
U40  DRV5056  [SOT-23]
U41  DRV5056  [SOT-23]
U42  DRV5056  [SOT-23]
U43  DRV5056  [SOT-23]
U44  DRV5056  [SOT-23]
U45  DRV5056  [SOT-23]
U46  DRV5056  [SOT-23]
U47  DRV5056  [SOT-23]
U48  DRV5056  [SOT-23]
U49  DRV5056  [SOT-23]
U50  DRV5056  [SOT-23]
U51  DRV5056  [SOT-23]
U52  DRV5056  [SOT-23]
U53  DRV5056  [SOT-23]
U54  DRV5056  [SOT-23]
U55  DRV5056  [SOT-23]
U56  DRV5056  [SOT-23]
U57  DRV5056  [SOT-23]
U58  DRV5056  [SOT-23]
U59  DRV5056  [SOT-23]
U60  DRV5056  [SOT-23]
U61  DRV5056  [SOT-23]
U62  DRV5056  [SOT-23]
U63  DRV5056  [SOT-23]
U64  DRV5056  [SOT-23]
U65  DRV5056  [SOT-23]
U66  DRV5056  [SOT-23]
U67  DRV5056  [SOT-23]
U68  DRV5056  [SOT-23]
U69  DRV5056  [SOT-23]
U70  DRV5056  [SOT-23]
U71  DRV5056  [SOT-23]
U72  DRV5056  [SOT-23]
U73  DRV5056  [SOT-23]
U74  DRV5056  [SOT-23]
U75  DRV5056  [SOT-23]
U76  DRV5056  [SOT-23]
U77  LM358S  [SOIC8]  (parts A,B of 2)
U78  LM358S  [SOIC8]  (parts A,B of 2)
U79  LM358S  [SOIC8]  (parts A,B of 2)
U80  LM358S  [SOIC8]  (parts A,B of 2)

## Nets
5V: C33.2 C34.2 C35.2 C36.2 C37.2 C38.2 C39.2 C40.2 C41.2 C42.2 C43.2 C44.2 C45.2 C46.2 C47.2 C48.2 C49.2 C50.2 C51.2 C52.2 C53.2 C54.2 C55.2 C56.2 C57.2 C58.2 C59.2 C60.2 C61.2 C62.2 C63.2 C64.2 C65.2 C66.2 C67.2 C68.2 C69.2 C70.2 C71.2 C72.2 C73.2 C74.2 C75.2 C76.2 C77.2 C78.2 C79.2 C80.2 C81.2 C82.2 C83.2 C84.2 C85.2 C86.2 C87.2 C88.2 C89.2 C90.2 C91.2 C92.2 C93.2 C94.2 C95.2 C96.2 C97.2 C98.2 C99.2 C100.2 C101.2 C102.2 C103.2 C104.2 C113.2 C115.2 C117.2 C119.2 Q1.2(S) Q2.2(S) Q3.2(S) Q4.2(S) Q5.2(S) Q6.2(S) Q7.2(S) Q8.2(S) Q9.2(S) Q10.2(S) Q11.2(S) Q12.2(S) Q13.2(S) Q14.2(S) Q15.2(S) Q16.2(S) Q17.2(S) Q18.2(S) Q19.2(S) Q20.2(S) Q21.2(S) Q22.2(S) Q23.2(S) Q24.2(S) Q25.2(S) Q26.2(S) Q27.2(S) Q28.2(S) Q29.2(S) Q30.2(S) Q31.2(S) Q32.2(S) Q33.2(S) Q34.2(S) Q35.2(S) Q36.2(S) Q37.2(S) Q38.2(S) Q39.2(S) Q40.2(S) Q41.2(S) Q42.2(S) Q43.2(S) Q44.2(S) Q45.2(S) Q46.2(S) Q47.2(S) Q48.2(S) Q49.2(S) Q50.2(S) Q51.2(S) Q52.2(S) Q53.2(S) Q54.2(S) Q55.2(S) Q56.2(S) Q57.2(S) Q58.2(S) Q59.2(S) Q60.2(S) Q61.2(S) Q62.2(S) Q63.2(S) Q64.2(S) R10.1 R11.1 R12.1 R13.1 R14.1 R15.1 R16.1 R23.1 R32.1 R33.1 R34.1 R35.1 R36.1 R37.1 R38.1 R39.1 R48.1 R49.1 R50.1 R51.1 R52.1 R53.1 R54.1 R55.1 R64.1 R65.1 R66.1 R67.1 R68.1 R69.1 R70.1 R71.1 R80.1 R81.1 R82.1 R83.1 R84.1 R85.1 R86.1 R87.1 R96.1 R97.1 R98.1 R99.1 R100.1 R101.1 R102.1 R103.1 R112.1 R113.1 R114.1 R115.1 R116.1 R117#1.1 R117#2.1 R118#1.1 R119.1 R128.1 R129.1 R130.1 R131.1 R132.1 R133.1 R134.1 R135.1 U2.10(~{SRCLR}) U2.16(VCC) U3.10(~{SRCLR}) U3.16(VCC) U4.10(~{SRCLR}) U4.16(VCC) U5.10(~{SRCLR}) U5.16(VCC) U6.10(~{SRCLR}) U6.16(VCC) U7.10(~{SRCLR}) U7.16(VCC) U8.10(~{SRCLR}) U8.16(VCC) U9.10(~{SRCLR}) U9.16(VCC) U77.8(V+) U78.8(V+) U79.8(V+) U80.8(V+)
GND: C25.1 C26.1 C27.1 C28.1 C29.1 C33.1 C34.1 C35.1 C36.1 C37.1 C38.1 C39.1 C40.1 C41.1 C42.1 C43.1 C44.1 C45.1 C46.1 C47.1 C48.1 C49.1 C50.1 C51.1 C52.1 C53.1 C54.1 C55.1 C56.1 C57.1 C58.1 C59.1 C60.1 C61.1 C62.1 C63.1 C64.1 C65.1 C66.1 C67.1 C68.1 C69.1 C70.1 C71.1 C72.1 C73.1 C74.1 C75.1 C76.1 C77.1 C78.1 C79.1 C80.1 C81.1 C82.1 C83.1 C84.1 C85.1 C86.1 C87.1 C88.1 C89.1 C90.1 C91.1 C92.1 C93.1 C94.1 C95.1 C96.1 C97.1 C98.1 C99.1 C100.1 C101.1 C102.1 C103.1 C104.1 C108.2 C109.1 C110.1 C111.1 C112.2 C113.1 C114.1 C115.1 C117.1 C119.1 R118#2.2 U2.8(GND) U2.13(~{OE}) U3.8(GND) U3.13(~{OE}) U4.8(GND) U4.13(~{OE}) U5.8(GND) U5.13(~{OE}) U6.8(GND) U6.13(~{OE}) U7.8(GND) U7.13(~{OE}) U8.8(GND) U8.13(~{OE}) U9.8(GND) U9.13(~{OE}) U13.3(GND) U14.3(GND) U15.3(GND) U16.3(GND) U17.3(GND) U18.3(GND) U19.3(GND) U20.3(GND) U21.3(GND) U22.3(GND) U23.3(GND) U24.3(GND) U25.3(GND) U26.3(GND) U27.3(GND) U28.3(GND) U29.3(GND) U30.3(GND) U31.3(GND) U32.3(GND) U33.3(GND) U34.3(GND) U35.3(GND) U36.3(GND) U37.3(GND) U38.3(GND) U39.3(GND) U40.3(GND) U41.3(GND) U42.3(GND) U43.3(GND) U44.3(GND) U45.3(GND) U46.3(GND) U47.3(GND) U48.3(GND) U49.3(GND) U50.3(GND) U51.3(GND) U52.3(GND) U53.3(GND) U54.3(GND) U55.3(GND) U56.3(GND) U57.3(GND) U58.3(GND) U59.3(GND) U60.3(GND) U61.3(GND) U62.3(GND) U63.3(GND) U64.3(GND) U65.3(GND) U66.3(GND) U67.3(GND) U68.3(GND) U69.3(GND) U70.3(GND) U71.3(GND) U72.3(GND) U73.3(GND) U74.3(GND) U75.3(GND) U76.3(GND) U77.4(V-) U78.4(V-) U79.4(V-) U80.4(V-)
ADC1: C25.2 R156.1
ADC2: C26.2 R157.1
ADC3: C27.2 R158.1
ADC4: C28.2 R159.1
ADC5: C109.2 R149.1
ADC6: C110.2 R150.1
ADC7: C111.2 R151.1
ADC8: C29.2 R160.1
Data: U9.14(SER)
Fclk: U2.11(SRCLK) U3.11(SRCLK) U4.11(SRCLK) U5.11(SRCLK) U6.11(SRCLK) U7.11(SRCLK) U8.11(SRCLK) U9.11(SRCLK)
GND_SS: C108.1 C112.1 C114.2 R117#2.2 R118#2.1 R161.2 R163.2 R165.2 R167.2 R169.2 R171.2 R173.2 R175.2
Sclk: U2.12(RCLK) U3.12(RCLK) U4.12(RCLK) U5.12(RCLK) U6.12(RCLK) U7.12(RCLK) U8.12(RCLK) U9.12(RCLK)
SSA1: R24.1 U2.15(QA)
SSA2: R40.1 U2.1(QB)
SSA3: R56.1 U2.2(QC)
SSA4: R72.1 U2.3(QD)
SSA5: R88.1 U2.4(QE)
SSA6: R104.1 U2.5(QF)
SSA7: R120.1 U2.6(QG)
SSA8: R136.1 U2.7(QH)
SSB1: R25.1 U3.15(QA)
SSB2: R41.1 U3.1(QB)
SSB3: R57.1 U3.2(QC)
SSB4: R73.1 U3.3(QD)
SSB5: R89.1 U3.4(QE)
SSB6: R105.1 U3.5(QF)
SSB7: R121.1 U3.6(QG)
SSB8: R137.1 U3.7(QH)
SSC1: R26.1 U4.15(QA)
SSC2: R42.1 U4.1(QB)
SSC3: R58.1 U4.2(QC)
SSC4: R74.1 U4.3(QD)
SSC5: R90.1 U4.4(QE)
SSC6: R106.1 U4.5(QF)
SSC7: R122.1 U4.6(QG)
SSC8: R138.1 U4.7(QH)
SSD1: R27.1 U5.15(QA)
SSD2: R43.1 U5.1(QB)
SSD3: R59.1 U5.2(QC)
SSD4: R75.1 U5.3(QD)
SSD5: R91.1 U5.4(QE)
SSD6: R107.1 U5.5(QF)
SSD7: R123.1 U5.6(QG)
SSD8: R140.1 U5.7(QH)
SSE1: R28.1 U6.15(QA)
SSE2: R44.1 U6.1(QB)
SSE3: R60.1 U6.2(QC)
SSE4: R76.1 U6.3(QD)
SSE5: R92.1 U6.4(QE)
SSE6: R108.1 U6.5(QF)
SSE7: R124.1 U6.6(QG)
SSE8: R141.1 U6.7(QH)
SSF1: R29.1 U7.15(QA)
SSF2: R45.1 U7.1(QB)
SSF3: R61.1 U7.2(QC)
SSF4: R77.1 U7.3(QD)
SSF5: R93.1 U7.4(QE)
SSF6: R109.1 U7.5(QF)
SSF7: R125.1 U7.6(QG)
SSF8: R142.1 U7.7(QH)
SSG1: R30.1 U8.15(QA)
SSG2: R46.1 U8.1(QB)
SSG3: R62.1 U8.2(QC)
SSG4: R78.1 U8.3(QD)
SSG5: R94.1 U8.4(QE)
SSG6: R110.1 U8.5(QF)
SSG7: R126.1 U8.6(QG)
SSG8: R143.1 U8.7(QH)
SSH1: R31.1 U9.15(QA)
SSH2: R47.1 U9.1(QB)
SSH3: R63.1 U9.2(QC)
SSH4: R79.1 U9.3(QD)
SSH5: R95.1 U9.4(QE)
SSH6: R111.1 U9.5(QF)
SSH7: R127.1 U9.6(QG)
SSH8: R144.1 U9.7(QH)
NetD1_1: D1.1(A) U13.2(OUT)
NetD1_2: D1.2(K) D14.2(K) D22.2(K) D30.2(K) D38.2(K) D46.2(K) D54.2(K) D62.2(K) U77.3(IN+)
NetD2_1: D2.1(A) U14.2(OUT)
NetD2_2: D2.2(K) D15.2(K) D23.2(K) D31.2(K) D39.2(K) D47.2(K) D55.2(K) D63.2(K) U77.5(IN+)
NetD3_1: D3.1(A) U15.2(OUT)
NetD3_2: D3.2(K) D16.2(K) D24.2(K) D32.2(K) D40.2(K) D48.2(K) D56.2(K) D64.2(K) U78.3(IN+)
NetD4_1: D4.1(A) U16.2(OUT)
NetD4_2: D4.2(K) D17.2(K) D25.2(K) D33.2(K) D41.2(K) D49.2(K) D57.2(K) D65.2(K) U78.5(IN+)
NetD5_1: D5.1(A) U17.2(OUT)
NetD5_2: D5.2(K) D18.2(K) D26.2(K) D34.2(K) D42.2(K) D50.2(K) D58.2(K) D66.2(K) U79.3(IN+)
NetD6_1: D6.1(A) U18.2(OUT)
NetD6_2: D6.2(K) D19.2(K) D27.2(K) D35.2(K) D43.2(K) D51.2(K) D59.2(K) D67.2(K) U79.5(IN+)
NetD7_1: D7.1(A) U19.2(OUT)
NetD7_2: D7.2(K) D20.2(K) D28.2(K) D36.2(K) D44.2(K) D52.2(K) D60.2(K) D68.2(K) U80.3(IN+)
NetD8_1: D8.1(A) U20.2(OUT)
NetD8_2: D8.2(K) D21.2(K) D29.2(K) D37.2(K) D45.2(K) D53.2(K) D61.2(K) D69.2(K) U80.5(IN+)
NetD14_1: D14.1(A) U21.2(OUT)
NetD15_1: D15.1(A) U22.2(OUT)
NetD16_1: D16.1(A) U23.2(OUT)
NetD17_1: D17.1(A) U24.2(OUT)
NetD18_1: D18.1(A) U25.2(OUT)
NetD19_1: D19.1(A) U26.2(OUT)
NetD20_1: D20.1(A) U27.2(OUT)
NetD21_1: D21.1(A) U28.2(OUT)
NetD22_1: D22.1(A) U29.2(OUT)
NetD23_1: D23.1(A) U30.2(OUT)
NetD24_1: D24.1(A) U31.2(OUT)
NetD25_1: D25.1(A) U32.2(OUT)
NetD26_1: D26.1(A) U33.2(OUT)
NetD27_1: D27.1(A) U34.2(OUT)
NetD28_1: D28.1(A) U35.2(OUT)
NetD29_1: D29.1(A) U36.2(OUT)
NetD30_1: D30.1(A) U37.2(OUT)
NetD31_1: D31.1(A) U38.2(OUT)
NetD32_1: D32.1(A) U39.2(OUT)
NetD33_1: D33.1(A) U40.2(OUT)
NetD34_1: D34.1(A) U41.2(OUT)
NetD35_1: D35.1(A) U42.2(OUT)
NetD36_1: D36.1(A) U43.2(OUT)
NetD37_1: D37.1(A) U44.2(OUT)
NetD38_1: D38.1(A) U45.2(OUT)
NetD39_1: D39.1(A) U46.2(OUT)
NetD40_1: D40.1(A) U47.2(OUT)
NetD41_1: D41.1(A) U48.2(OUT)
NetD42_1: D42.1(A) U49.2(OUT)
NetD43_1: D43.1(A) U50.2(OUT)
NetD44_1: D44.1(A) U51.2(OUT)
NetD45_1: D45.1(A) U52.2(OUT)
NetD46_1: D46.1(A) U53.2(OUT)
NetD47_1: D47.1(A) U54.2(OUT)
NetD48_1: D48.1(A) U55.2(OUT)
NetD49_1: D49.1(A) U56.2(OUT)
NetD50_1: D50.1(A) U57.2(OUT)
NetD51_1: D51.1(A) U58.2(OUT)
NetD52_1: D52.1(A) U59.2(OUT)
NetD53_1: D53.1(A) U60.2(OUT)
NetD54_1: D54.1(A) U61.2(OUT)
NetD55_1: D55.1(A) U62.2(OUT)
NetD56_1: D56.1(A) U63.2(OUT)
NetD57_1: D57.1(A) U64.2(OUT)
NetD58_1: D58.1(A) U65.2(OUT)
NetD59_1: D59.1(A) U66.2(OUT)
NetD60_1: D60.1(A) U67.2(OUT)
NetD61_1: D61.1(A) U68.2(OUT)
NetD62_1: D62.1(A) U69.2(OUT)
NetD63_1: D63.1(A) U70.2(OUT)
NetD64_1: D64.1(A) U71.2(OUT)
NetD65_1: D65.1(A) U72.2(OUT)
NetD66_1: D66.1(A) U73.2(OUT)
NetD67_1: D67.1(A) U74.2(OUT)
NetD68_1: D68.1(A) U75.2(OUT)
NetD69_1: D69.1(A) U76.2(OUT)
NetQ1_1: Q1.1(G) R10.2 R24.2
NetQ1_3: Q1.3(D) U13.1(VCC)
NetQ2_1: Q2.1(G) R11.2 R25.2
NetQ2_3: Q2.3(D) U14.1(VCC)
NetQ3_1: Q3.1(G) R12.2 R26.2
NetQ3_3: Q3.3(D) U15.1(VCC)
NetQ4_1: Q4.1(G) R13.2 R27.2
NetQ4_3: Q4.3(D) U16.1(VCC)
NetQ5_1: Q5.1(G) R14.2 R28.2
NetQ5_3: Q5.3(D) U17.1(VCC)
NetQ6_1: Q6.1(G) R15.2 R29.2
NetQ6_3: Q6.3(D) U18.1(VCC)
NetQ7_1: Q7.1(G) R16.2 R30.2
NetQ7_3: Q7.3(D) U19.1(VCC)
NetQ8_1: Q8.1(G) R23.2 R31.2
NetQ8_3: Q8.3(D) U20.1(VCC)
NetQ9_1: Q9.1(G) R32.2 R40.2
NetQ9_3: Q9.3(D) U21.1(VCC)
NetQ10_1: Q10.1(G) R33.2 R41.2
NetQ10_3: Q10.3(D) U22.1(VCC)
NetQ11_1: Q11.1(G) R34.2 R42.2
NetQ11_3: Q11.3(D) U23.1(VCC)
NetQ12_1: Q12.1(G) R35.2 R43.2
NetQ12_3: Q12.3(D) U24.1(VCC)
NetQ13_1: Q13.1(G) R36.2 R44.2
NetQ13_3: Q13.3(D) U25.1(VCC)
NetQ14_1: Q14.1(G) R37.2 R45.2
NetQ14_3: Q14.3(D) U26.1(VCC)
NetQ15_1: Q15.1(G) R38.2 R46.2
NetQ15_3: Q15.3(D) U27.1(VCC)
NetQ16_1: Q16.1(G) R39.2 R47.2
NetQ16_3: Q16.3(D) U28.1(VCC)
NetQ17_1: Q17.1(G) R48.2 R56.2
NetQ17_3: Q17.3(D) U29.1(VCC)
NetQ18_1: Q18.1(G) R49.2 R57.2
NetQ18_3: Q18.3(D) U30.1(VCC)
NetQ19_1: Q19.1(G) R50.2 R58.2
NetQ19_3: Q19.3(D) U31.1(VCC)
NetQ20_1: Q20.1(G) R51.2 R59.2
NetQ20_3: Q20.3(D) U32.1(VCC)
NetQ21_1: Q21.1(G) R52.2 R60.2
NetQ21_3: Q21.3(D) U33.1(VCC)
NetQ22_1: Q22.1(G) R53.2 R61.2
NetQ22_3: Q22.3(D) U34.1(VCC)
NetQ23_1: Q23.1(G) R54.2 R62.2
NetQ23_3: Q23.3(D) U35.1(VCC)
NetQ24_1: Q24.1(G) R55.2 R63.2
NetQ24_3: Q24.3(D) U36.1(VCC)
NetQ25_1: Q25.1(G) R64.2 R72.2
NetQ25_3: Q25.3(D) U37.1(VCC)
NetQ26_1: Q26.1(G) R65.2 R73.2
NetQ26_3: Q26.3(D) U38.1(VCC)
NetQ27_1: Q27.1(G) R66.2 R74.2
NetQ27_3: Q27.3(D) U39.1(VCC)
NetQ28_1: Q28.1(G) R67.2 R75.2
NetQ28_3: Q28.3(D) U40.1(VCC)
NetQ29_1: Q29.1(G) R68.2 R76.2
NetQ29_3: Q29.3(D) U41.1(VCC)
NetQ30_1: Q30.1(G) R69.2 R77.2
NetQ30_3: Q30.3(D) U42.1(VCC)
NetQ31_1: Q31.1(G) R70.2 R78.2
NetQ31_3: Q31.3(D) U43.1(VCC)
NetQ32_1: Q32.1(G) R71.2 R79.2
NetQ32_3: Q32.3(D) U44.1(VCC)
NetQ33_1: Q33.1(G) R80.2 R88.2
NetQ33_3: Q33.3(D) U45.1(VCC)
NetQ34_1: Q34.1(G) R81.2 R89.2
NetQ34_3: Q34.3(D) U46.1(VCC)
NetQ35_1: Q35.1(G) R82.2 R90.2
NetQ35_3: Q35.3(D) U47.1(VCC)
NetQ36_1: Q36.1(G) R83.2 R91.2
NetQ36_3: Q36.3(D) U48.1(VCC)
NetQ37_1: Q37.1(G) R84.2 R92.2
NetQ37_3: Q37.3(D) U49.1(VCC)
NetQ38_1: Q38.1(G) R85.2 R93.2
NetQ38_3: Q38.3(D) U50.1(VCC)
NetQ39_1: Q39.1(G) R86.2 R94.2
NetQ39_3: Q39.3(D) U51.1(VCC)
NetQ40_1: Q40.1(G) R87.2 R95.2
NetQ40_3: Q40.3(D) U52.1(VCC)
NetQ41_1: Q41.1(G) R96.2 R104.2
NetQ41_3: Q41.3(D) U53.1(VCC)
NetQ42_1: Q42.1(G) R97.2 R105.2
NetQ42_3: Q42.3(D) U54.1(VCC)
NetQ43_1: Q43.1(G) R98.2 R106.2
NetQ43_3: Q43.3(D) U55.1(VCC)
NetQ44_1: Q44.1(G) R99.2 R107.2
NetQ44_3: Q44.3(D) U56.1(VCC)
NetQ45_1: Q45.1(G) R100.2 R108.2
NetQ45_3: Q45.3(D) U57.1(VCC)
NetQ46_1: Q46.1(G) R101.2 R109.2
NetQ46_3: Q46.3(D) U58.1(VCC)
NetQ47_1: Q47.1(G) R102.2 R110.2
NetQ47_3: Q47.3(D) U59.1(VCC)
NetQ48_1: Q48.1(G) R103.2 R111.2
NetQ48_3: Q48.3(D) U60.1(VCC)
NetQ49_1: Q49.1(G) R112.2 R120.2
NetQ49_3: Q49.3(D) U61.1(VCC)
NetQ50_1: Q50.1(G) R113.2 R121.2
NetQ50_3: Q50.3(D) U62.1(VCC)
NetQ51_1: Q51.1(G) R114.2 R122.2
NetQ51_3: Q51.3(D) U63.1(VCC)
NetQ52_1: Q52.1(G) R115.2 R123.2
NetQ52_3: Q52.3(D) U64.1(VCC)
NetQ53_1: Q53.1(G) R116.2 R124.2
NetQ53_3: Q53.3(D) U65.1(VCC)
NetQ54_1: Q54.1(G) R117#1.2 R125.2
NetQ54_3: Q54.3(D) U66.1(VCC)
NetQ55_1: Q55.1(G) R118#1.2 R126.2
NetQ55_3: Q55.3(D) U67.1(VCC)
NetQ56_1: Q56.1(G) R119.2 R127.2
NetQ56_3: Q56.3(D) U68.1(VCC)
NetQ57_1: Q57.1(G) R128.2 R136.2
NetQ57_3: Q57.3(D) U69.1(VCC)
NetQ58_1: Q58.1(G) R129.2 R137.2
NetQ58_3: Q58.3(D) U70.1(VCC)
NetQ59_1: Q59.1(G) R130.2 R138.2
NetQ59_3: Q59.3(D) U71.1(VCC)
NetQ60_1: Q60.1(G) R131.2 R140.2
NetQ60_3: Q60.3(D) U72.1(VCC)
NetQ61_1: Q61.1(G) R132.2 R141.2
NetQ61_3: Q61.3(D) U73.1(VCC)
NetQ62_1: Q62.1(G) R133.2 R142.2
NetQ62_3: Q62.3(D) U74.1(VCC)
NetQ63_1: Q63.1(G) R134.2 R143.2
NetQ63_3: Q63.3(D) U75.1(VCC)
NetQ64_1: Q64.1(G) R135.2 R144.2
NetQ64_3: Q64.3(D) U76.1(VCC)
NetR149_2: R149.2 R166.1 U79.1(OUT)
NetR150_2: R150.2 R168.1 U79.7(OUT)
NetR151_2: R151.2 R170.1 U80.1(OUT)
NetR156_2: R156.2 R174.1 U77.1(OUT)
NetR157_2: R157.2 R176.1 U77.7(OUT)
NetR158_2: R158.2 R162.1 U78.1(OUT)
NetR159_2: R159.2 R164.1 U78.7(OUT)
NetR160_2: R160.2 R172.1 U80.7(OUT)
NetR161_1: R161.1 R162.2 U78.2(IN-)
NetR163_1: R163.1 R164.2 U78.6(IN-)
NetR165_1: R165.1 R166.2 U79.2(IN-)
NetR167_1: R167.1 R168.2 U79.6(IN-)
NetR169_1: R169.1 R170.2 U80.2(IN-)
NetR171_1: R171.1 R172.2 U80.6(IN-)
NetR173_1: R173.1 R174.2 U77.2(IN-)
NetR175_1: R175.1 R176.2 U77.6(IN-)
NetU2_14: U2.14(SER) U3.9(QH')
NetU3_14: U3.14(SER) U4.9(QH')
NetU4_14: U4.14(SER) U5.9(QH')
NetU5_14: U5.14(SER) U6.9(QH')
NetU6_14: U6.14(SER) U7.9(QH')
NetU7_14: U7.14(SER) U8.9(QH')
NetU8_14: U8.14(SER) U9.9(QH')

Not connected (* = marked no-connect by the designer): U2 9(QH')

## Notes on the sheet
- LEFT
- DOWN
- RIGHT
- UP

## Library data of the parts
C25-C29 C109-C111 C113-C115 C117 C119 = Cap-NP-100: 100nF ±10% 50V X7R 0805 Multilayer Ceramic Capacitors MLCC - SMD/SMT RoHS; MANUFACTURER1: TORCH; MANUFACTURER1_PART#: C0805B104K500NT; MANUFACTURER2_PART#: TCC0805X7R104K500DT; PACKING: Tape & Reel (TR); PCB Footprint: 0805; Process Type: SM; Unit: PCS; By: Thanh Son; Value: 0.1uF; MANUFACTURER2: CCTC; Material: X7R; Category: Cap Cereramic; Mounting Type: SM; Package / Case: 0805; Supplier 1: LCSC
C33-C104 = Cap-NP-100: 100nF ±10% 50V X7R 0805 Multilayer Ceramic Capacitors MLCC - SMD/SMT RoHS; MANUFACTURER1: TORCH; MANUFACTURER1_PART#: C0805B104K500NT; MANUFACTURER2_PART#: TCC0805X7R104K500DT; PACKING: Tape & Reel (TR); Process Type: SM; Unit: PCS; By: Thanh Son; Value: 0.1uF; MANUFACTURER2: CCTC; Material: X7R; Category: Cap Cereramic; Mounting Type: SM; Package / Case: 0805; Supplier 1: LCSC
C108 C112 = Cap-NP-100: 10uF ±10% 35V X5R 0805 Multilayer Ceramic Capacitors MLCC - SMD/SMT RoHS; MANUFACTURER1: Murata Electronics; MANUFACTURER1_PART#: GRM21BR6YA106KE43L; MANUFACTURER2_PART#: C2012X5R1V106MT000E; PACKING: Tape & Reel (TR); PCB Footprint: 0805; Process Type: SM; Unit: PCS; By: Thanh Son; Value: 10uF; MANUFACTURER2: TDK; Tolerance: ±10%; Material: X5R; Category: Cap Cereramic; Mounting Type: SM; Package / Case: 0805; Supplier 1: LCSC
D1-D8 D14-D69 = diode SS14: 40V 1A 550mV @ 1A SMA(DO-214AC) Schottky Barrier Diodes (SBD) RoHS; MANUFACTURER1: Shandong Jingdao Microelectronics; MANUFACTURER1_PART#: SS14; PACKING: Tape & Reel; By: Thanh Son; Process Type: SM; Current: 1A; MANUFACTURER2: GOODWORK; MANUFACTURER2_PART#: SS14; Value: 550mV @ 1A; Voltage: 40V; Category: Diode/LED; Mounting Type: SM; Package / Case: DO-214AC; Supplier 1: LCSC
  D14: Parameter 1: *
Q1-Q64 = MOSFET P-CH 12V 8A 15.3mOhm SOT23-3: MOSFET P-CH 12V 8A 15mOhm SOT23; MANUFACTURER1: HUASHUO; MANUFACTURER2_PART#: G7P03L; By: Thanh Son; PACKING: Cut Tape (CT); Process Type: SM; Category: MOSFETs; Mounting Type: SM; Package / Case: SOT-23; Packaging: Cut Tape (CT); Supplier 1: LCSC; MANUFACTURER1_PART#: HSS2333; MANUFACTURER2: GOFORD
R10-R16 R23 R32-R39 R48-R55 R64-R71 R80-R87 R96-R103 R112-R116 R117#1 R118#1 R119 R128-R135 = Res0.3: 10kΩ ±1% 1/8W ±100ppm/℃ 0805 Chip Resistor - Surface Mount RoHS; MANUFACTURER1: UNI-ROYAL(Uniroyal Elec); MANUFACTURER1_PART#: 0805W8F1002T5E; MANUFACTURER2_PART#: RS-05K1002FT; PACKING: Tape & Reel (TR); Process Type: SM; Unit: PCS; By: Thanh Son; Value: 10k; MANUFACTURER2: FH(Guangdong Fenghua Advanced Tech); Category: Resistor; Mounting Type: SM; Package / Case: 0805; Supplier 1: LCSC
R24-R31 R40-R47 R56-R63 R72-R79 R88-R95 R104-R111 R120-R127 R136-R138 R140-R144 = Res0.3: 4.7Ω ±1% ±400ppm/℃ 0.125W 0805 Chip Resistor - Surface Mount ROHS; MANUFACTURER1: UNI-ROYAL(Uniroyal Elec); MANUFACTURER1_PART#: 0805W8F470KT5E; MANUFACTURER2_PART#: RC0805FR-074R7L; PACKING: Tape & Reel (TR); Process Type: SM; Unit: PCS; MANUFACTURER2: YAGEO; Category: Resistor; Mounting Type: SM; Package / Case: 0805; Supplier 1: LCSC
R117#2 R118#2 R149-R151 R156-R176 = Res0.3: 50V -55℃~+155℃ ±1% Anti-Sulfurated Thick Film Chip Resistors 62.5mW ±100ppm/℃ 1kΩ 0402 Chip Resistor - Surface Mount ROHS; MANUFACTURER1: FH(Guangdong Fenghua Advanced Tech); MANUFACTURER1_PART#: RS-05K1001FT; MANUFACTURER2_PART#: 0805W8F1001T5E; PACKING: Tape & Reel (TR); Process Type: SM; Unit: PCS; Value: 1K; MANUFACTURER2: UNI-ROYAL(Uniroyal Elec); Category: Resistor; Mounting Type: SM; Package / Case: 0805; Supplier 1: LCSC
U2-U9 = 74HC595B1R: Shift Register Tri-State SOIC-16_150mil 74 Series RoHS; MANUFACTURER1: Diodes Incorporated; MANUFACTURER1_PART#: 74HC595S16-13; MANUFACTURER2_PART#: SN74HC595DR; PACKING: Tape & Reel (TR); Process Type: SM; MANUFACTURER2: Texas Instruments; Category: IC; Mounting Type: SM; Package / Case: SOIC16; Supplier 1: LCSC
U13-U76 = Magnetic sensors DRV5056 SOT23: Board Mount Hall Effect / Magnetic Sensors Ratiometric unipolar linear hall effect sensor with analog output 3-SOT-23 -40 to 125; MANUFACTURER1: Texas Instruments; MANUFACTURER1_PART#: DRV5055A1QDBZR; PACKING: Tape & Reel (TR); Process Type: SM; Unit: PCS; Category: IC; Mounting Type: SM; Package / Case: SOT-23; Supplier 1: mouser
U77-U80 = LM358: SOP-8 Low Power OpAmps RoHS; MANUFACTURER1: Slkor(SLKORMICRO Elec.); PACKING: Tape & Reel (TR); Unit: PCS; Process Type: SM; MANUFACTURER1_PART#: LM358S; MANUFACTURER2: Shenzhen Fuman Elec; MANUFACTURER2_PART#: LM358S; Category: IC; Mounting Type: SM; Package / Case: SOP-8; Supplier 1: LCSC